# Altium schematic sheet AIRZAI_LED_STRIP_FLEX_REVA_10mmPitch.SchDoc
size A3
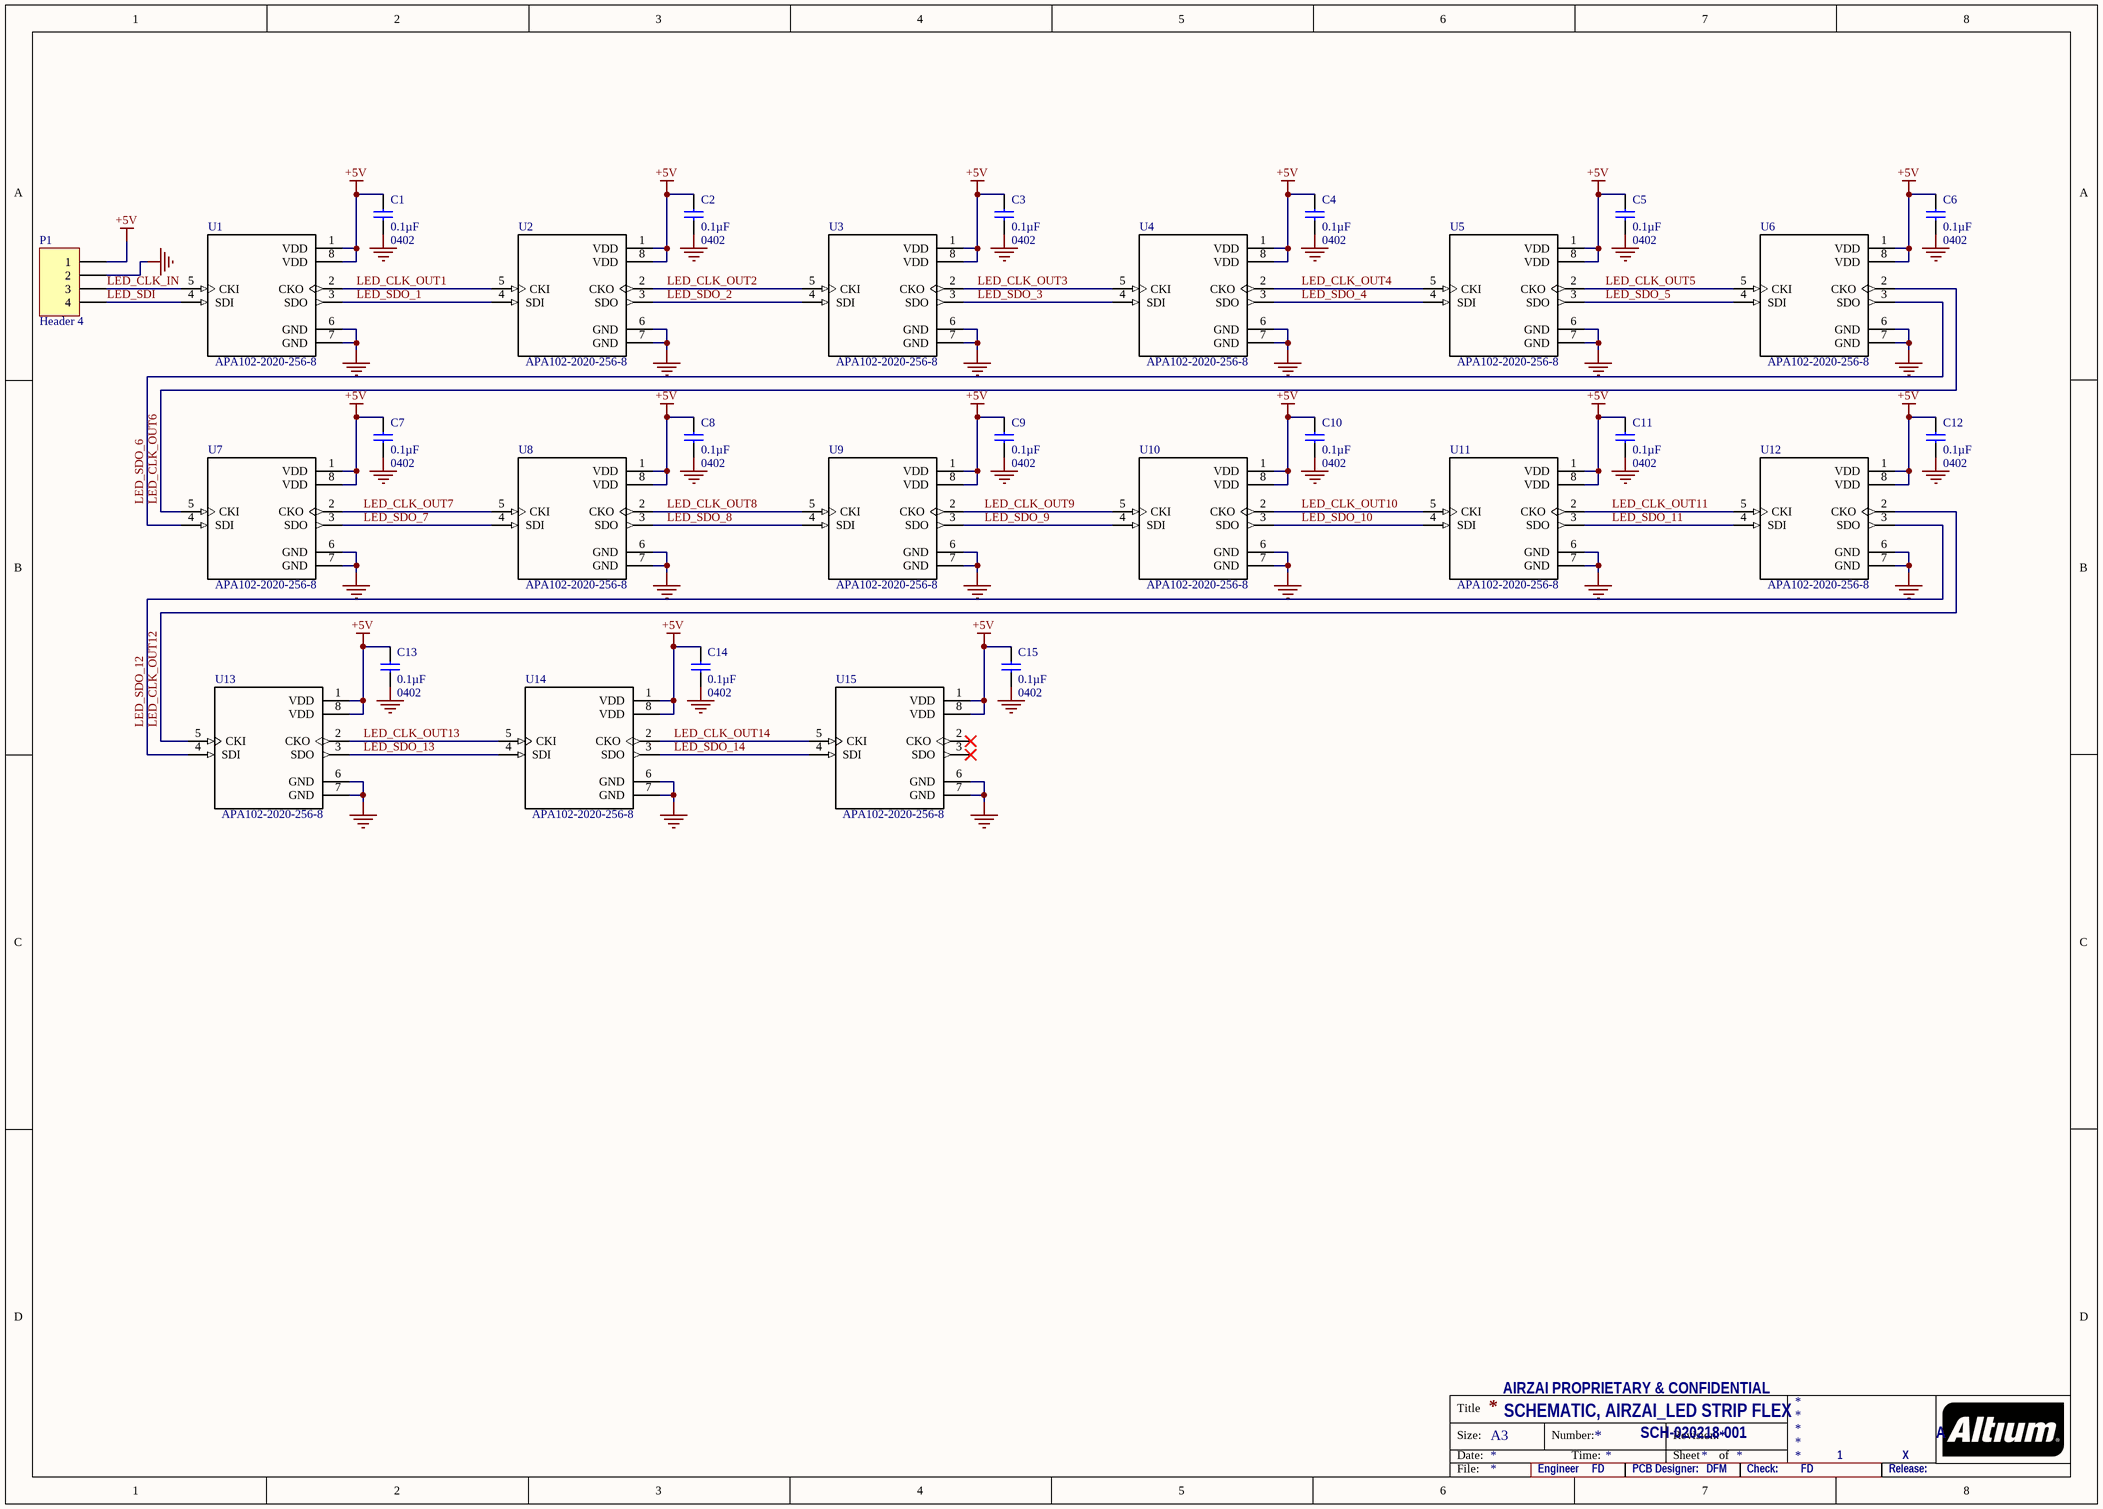
[diagram p0: AIRZAI_LED_STRIP_FLEX_REVA_10mmPitch.SchDoc]

## Parts
C1  0.1µF  Footprint: 0402  [0402CAP]
C2  0.1µF  Footprint: 0402  [0402CAP]
C3  0.1µF  Footprint: 0402  [0402CAP]
C4  0.1µF  Footprint: 0402  [0402CAP]
C5  0.1µF  Footprint: 0402  [0402CAP]
C6  0.1µF  Footprint: 0402  [0402CAP]
C7  0.1µF  Footprint: 0402  [0402CAP]
C8  0.1µF  Footprint: 0402  [0402CAP]
C9  0.1µF  Footprint: 0402  [0402CAP]
C10  0.1µF  Footprint: 0402  [0402CAP]
C11  0.1µF  Footprint: 0402  [0402CAP]
C12  0.1µF  Footprint: 0402  [0402CAP]
C13  0.1µF  Footprint: 0402  [0402CAP]
C14  0.1µF  Footprint: 0402  [0402CAP]
C15  0.1µF  Footprint: 0402  [0402CAP]
P1  Header 4  [FFC_4Pads]
U1  APA102-2020-256-8  [APA102–2020]
U2  APA102-2020-256-8  [APA102–2020]
U3  APA102-2020-256-8  [APA102–2020]
U4  APA102-2020-256-8  [APA102–2020]
U5  APA102-2020-256-8  [APA102–2020]
U6  APA102-2020-256-8  [APA102–2020]
U7  APA102-2020-256-8  [APA102–2020]
U8  APA102-2020-256-8  [APA102–2020]
U9  APA102-2020-256-8  [APA102–2020]
U10  APA102-2020-256-8  [APA102–2020]
U11  APA102-2020-256-8  [APA102–2020]
U12  APA102-2020-256-8  [APA102–2020]
U13  APA102-2020-256-8  [APA102–2020]
U14  APA102-2020-256-8  [APA102–2020]
U15  APA102-2020-256-8  [APA102–2020]

## Nets
+5V: C1.1 C2.1 C3.1 C4.1 C5.1 C6.1 C7.1 C8.1 C9.1 C10.1 C11.1 C12.1 C13.1 C14.1 C15.1 P1.1 U1.1(VDD) U1.8(VDD) U2.1(VDD) U2.8(VDD) U3.1(VDD) U3.8(VDD) U4.1(VDD) U4.8(VDD) U5.1(VDD) U5.8(VDD) U6.1(VDD) U6.8(VDD) U7.1(VDD) U7.8(VDD) U8.1(VDD) U8.8(VDD) U9.1(VDD) U9.8(VDD) U10.1(VDD) U10.8(VDD) U11.1(VDD) U11.8(VDD) U12.1(VDD) U12.8(VDD) U13.1(VDD) U13.8(VDD) U14.1(VDD) U14.8(VDD) U15.1(VDD) U15.8(VDD)
GND: C1.2 C2.2 C3.2 C4.2 C5.2 C6.2 C7.2 C8.2 C9.2 C10.2 C11.2 C12.2 C13.2 C14.2 C15.2 P1.2 U1.6(GND) U1.7(GND) U2.6(GND) U2.7(GND) U3.6(GND) U3.7(GND) U4.6(GND) U4.7(GND) U5.6(GND) U5.7(GND) U6.6(GND) U6.7(GND) U7.6(GND) U7.7(GND) U8.6(GND) U8.7(GND) U9.6(GND) U9.7(GND) U10.6(GND) U10.7(GND) U11.6(GND) U11.7(GND) U12.6(GND) U12.7(GND) U13.6(GND) U13.7(GND) U14.6(GND) U14.7(GND) U15.6(GND) U15.7(GND)
LED_CLK_IN: P1.3 U1.5(CKI)
LED_CLK_OUT1: U1.2(CKO) U2.5(CKI)
LED_CLK_OUT2: U2.2(CKO) U3.5(CKI)
LED_CLK_OUT3: U3.2(CKO) U4.5(CKI)
LED_CLK_OUT4: U4.2(CKO) U5.5(CKI)
LED_CLK_OUT5: U5.2(CKO) U6.5(CKI)
LED_CLK_OUT6: U6.2(CKO) U7.5(CKI)
LED_CLK_OUT7: U7.2(CKO) U8.5(CKI)
LED_CLK_OUT8: U8.2(CKO) U9.5(CKI)
LED_CLK_OUT9: U9.2(CKO) U10.5(CKI)
LED_CLK_OUT10: U10.2(CKO) U11.5(CKI)
LED_CLK_OUT11: U11.2(CKO) U12.5(CKI)
LED_CLK_OUT12: U12.2(CKO) U13.5(CKI)
LED_CLK_OUT13: U13.2(CKO) U14.5(CKI)
LED_CLK_OUT14: U14.2(CKO) U15.5(CKI)
LED_SDI: P1.4 U1.4(SDI)
LED_SDO_1: U1.3(SDO) U2.4(SDI)
LED_SDO_2: U2.3(SDO) U3.4(SDI)
LED_SDO_3: U3.3(SDO) U4.4(SDI)
LED_SDO_4: U4.3(SDO) U5.4(SDI)
LED_SDO_5: U5.3(SDO) U6.4(SDI)
LED_SDO_6: U6.3(SDO) U7.4(SDI)
LED_SDO_7: U7.3(SDO) U8.4(SDI)
LED_SDO_8: U8.3(SDO) U9.4(SDI)
LED_SDO_9: U9.3(SDO) U10.4(SDI)
LED_SDO_10: U10.3(SDO) U11.4(SDI)
LED_SDO_11: U11.3(SDO) U12.4(SDI)
LED_SDO_12: U12.3(SDO) U13.4(SDI)
LED_SDO_13: U13.3(SDO) U14.4(SDI)
LED_SDO_14: U14.3(SDO) U15.4(SDI)

Not connected (* = marked no-connect by the designer): U15 2(CKO)* 3(SDO)*

## Notes on the sheet
- AIRZAI PROPRIETARY & CONFIDENTIAL
- SCHEMATIC, AIRZAI_LED STRIP FLEX
- SCH-020218-001
- 1
- X
- A
- Engineer
- FD
- PCB Designer:
- DFM
- Check:
- Release:
- Title
- Size:
- Date:
- A3
- Number:
- Time:
- Revision:
- Sheet
- of
- File:

## Library data of the parts
C1-C15 = C0402-100n: Capacitor, X7R, ±10%; Manufacturer: TDK; Manufacturer Part Number: C1005X7R1C104K; Note: 16V ±10% X7R; Case-Metric: 1005; Rated Voltage: 16 V; Tolerance: Â±20%; Datasheet: *; Pin Count: 2; Value: 0.1µF; Supplier: *; Supplier part number: *; 2nd source Supplier: *; 2nd source part number: *; Case-EIA: 0402; Max Thickness: 0.6 mm; Supplier 1: Digi-Key; Supplier Part Number 1: 445-4952-2-ND; Technology: SMT
P1 = Header 4: Header, 4-Pin; LatestRevisionDate: 17-Jul-2002; LatestRevisionNote: Re-released for DXP Platform.; Publisher: Altium Limited
U1-U15 = APA102-2020-256-8: DotStar Micro LEDs; MF: Adafruit Industries; MP: APA-102-2020-256-8; SnapEDA_Link: https://www.snapeda.com/parts/APA-102-2020-256-8/APA%20Electronic%20/view-part/?ref=snap; Availability: Unavailable; Price: None; Package: SOIC-20 Adafruit Industries; Value: *